# Altium schematic sheet A2D_ascii.SchDoc
size 513 x 386 mm
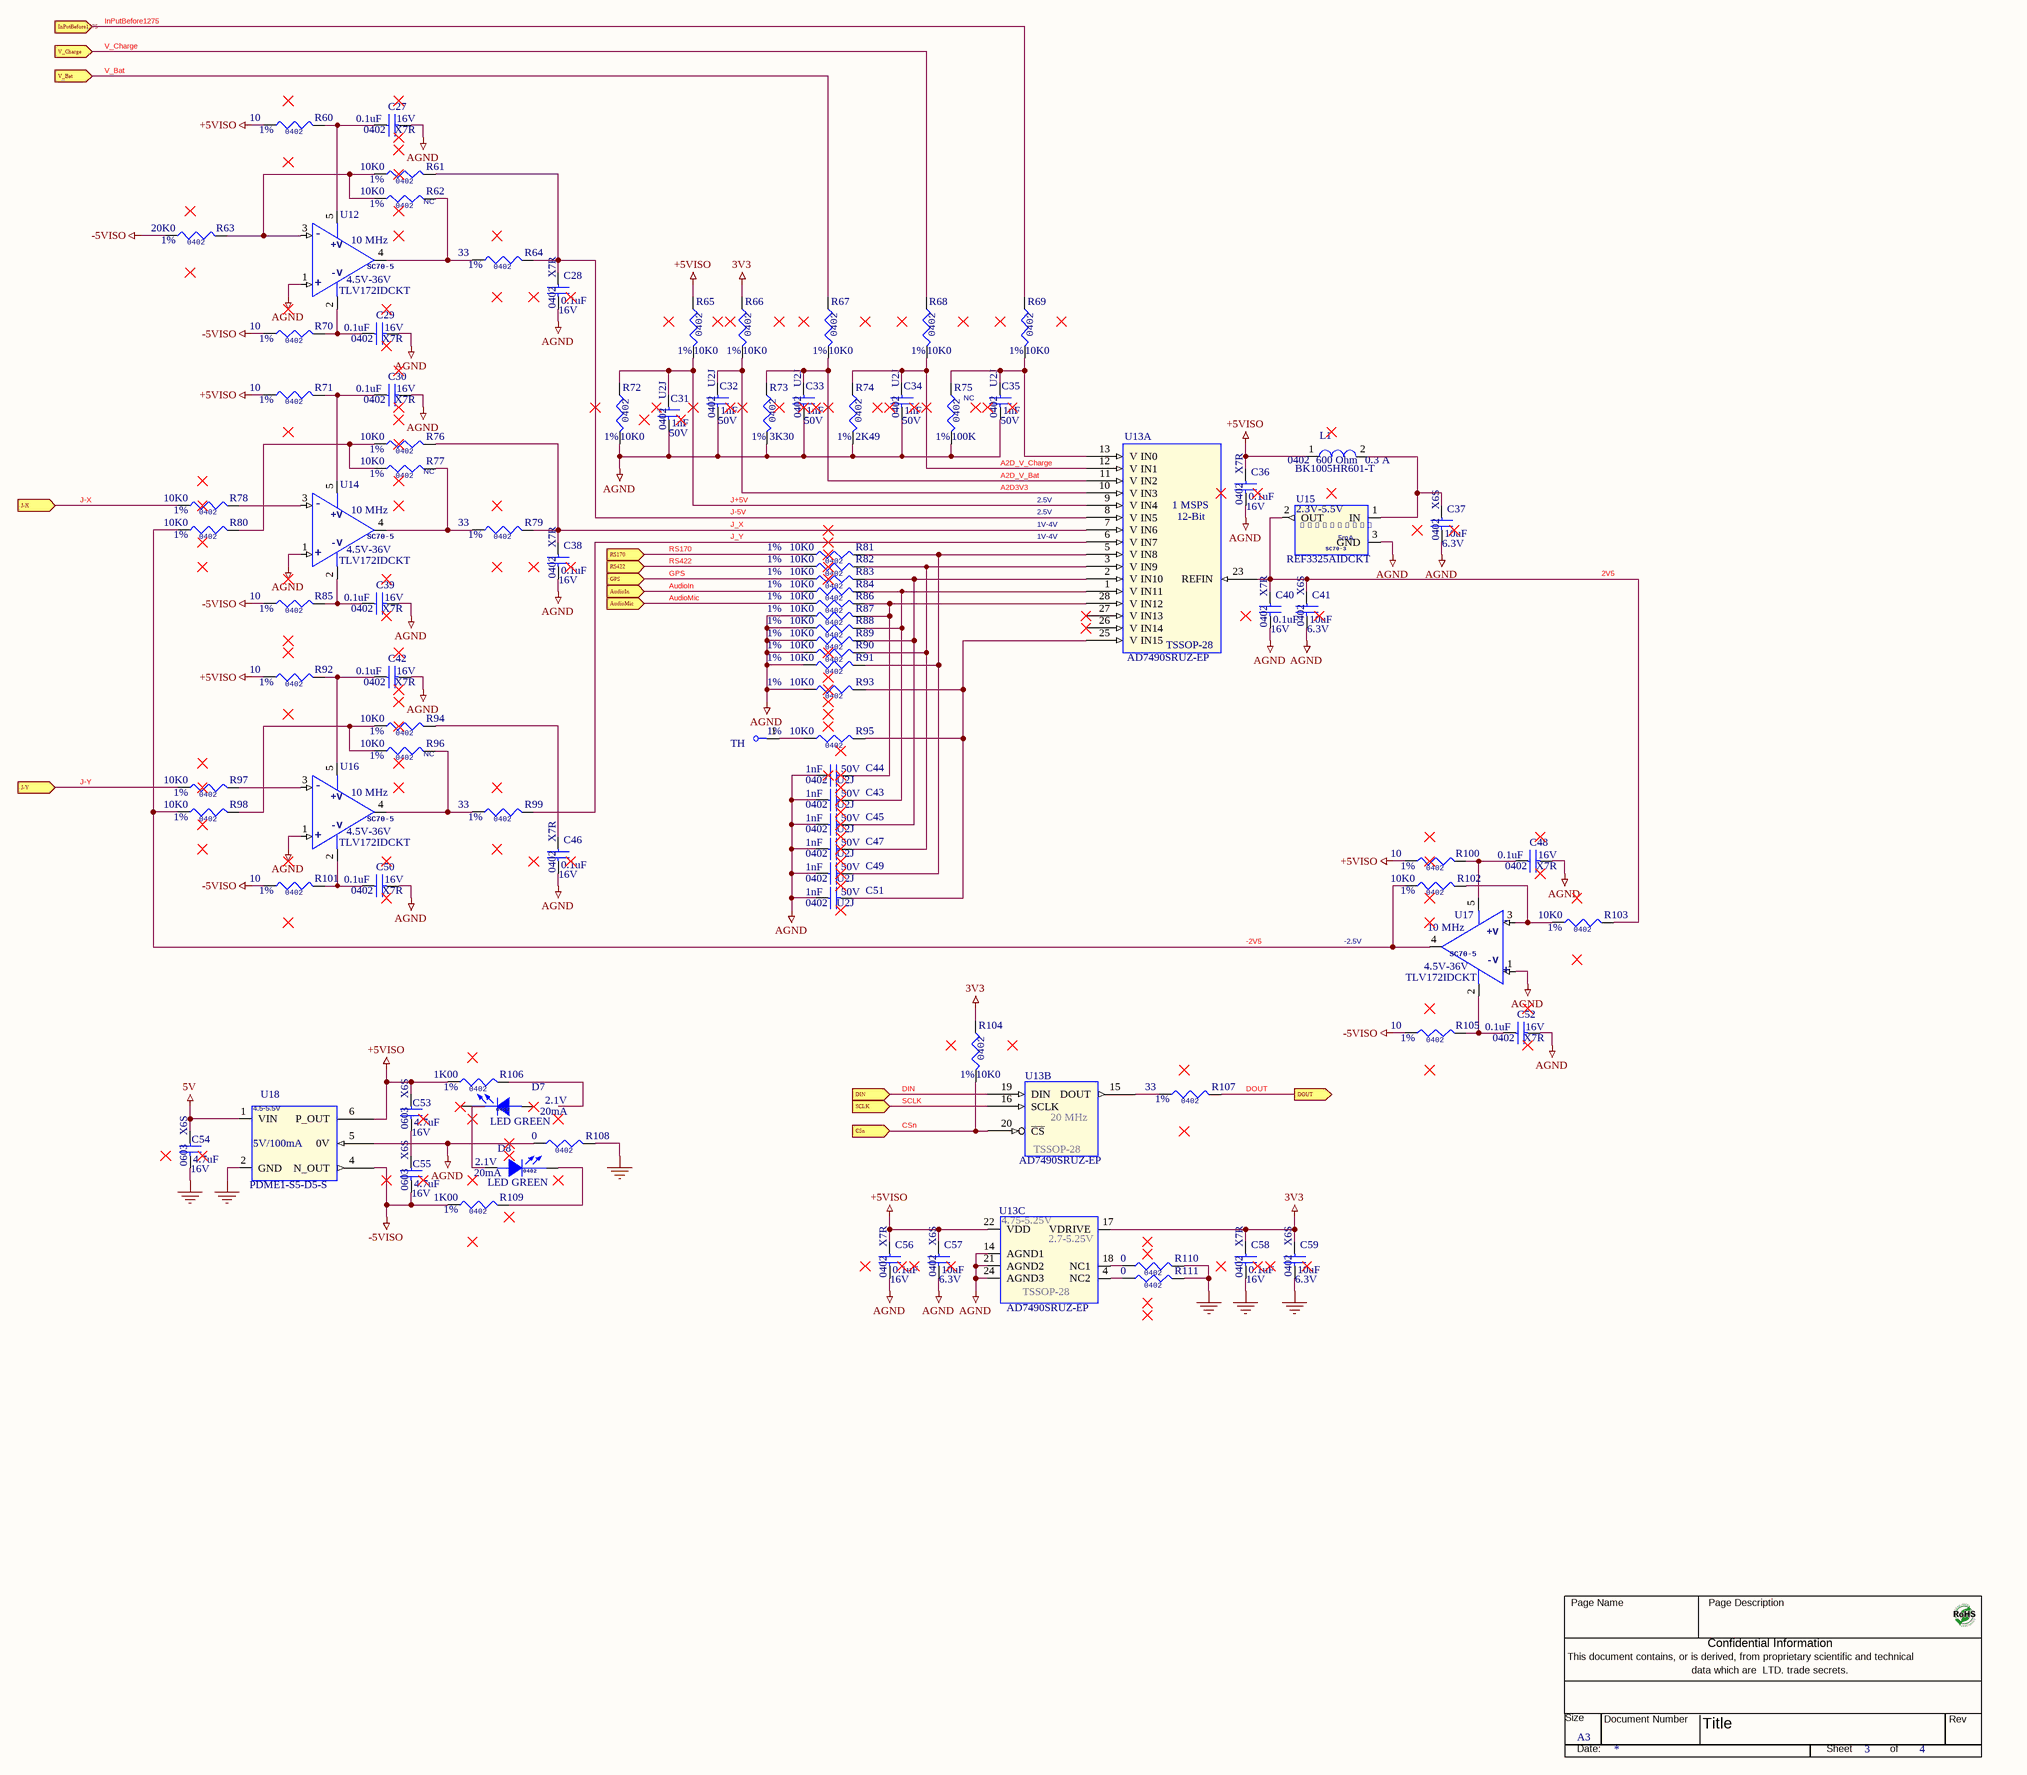
[diagram p0: A2D_ascii.SchDoc]

## Parts
*  Page Size: A3  Page Number: 3  Page Count: 4  (hidden comment: MobulusTitleBlockBlank)  (graphical)
C27  0.1uF  VOLTAGE: 16V  PCBFootPrint: 0402   X7R  [0402]
C28  0.1uF  VOLTAGE: 16V  PCBFootPrint: 0402   X7R  [0402]
C29  0.1uF  VOLTAGE: 16V  PCBFootPrint: 0402   X7R  [0402]
C30  0.1uF  VOLTAGE: 16V  PCBFootPrint: 0402   X7R  [0402]
C31  1nF  VOLTAGE: 50V  PCBFootPrint: 0402   U2J  [0402]
C32  1nF  VOLTAGE: 50V  PCBFootPrint: 0402   U2J  [0402]
C33  1nF  VOLTAGE: 50V  PCBFootPrint: 0402   U2J  [0402]
C34  1nF  VOLTAGE: 50V  PCBFootPrint: 0402   U2J  [0402]
C35  1nF  VOLTAGE: 50V  PCBFootPrint: 0402   U2J  [0402]
C36  0.1uF  VOLTAGE: 16V  PCBFootPrint: 0402   X7R  [0402]
C37  10uF  VOLTAGE: 6.3V  PCBFootPrint: 0402   X6S  [0402]
C38  0.1uF  VOLTAGE: 16V  PCBFootPrint: 0402   X7R  [0402]
C39  0.1uF  VOLTAGE: 16V  PCBFootPrint: 0402   X7R  [0402]
C40  0.1uF  VOLTAGE: 16V  PCBFootPrint: 0402   X7R  [0402]
C41  10uF  VOLTAGE: 6.3V  PCBFootPrint: 0402   X6S  [0402]
C42  0.1uF  VOLTAGE: 16V  PCBFootPrint: 0402   X7R  [0402]
C43  1nF  VOLTAGE: 50V  PCBFootPrint: 0402   U2J  [0402]
C44  1nF  VOLTAGE: 50V  PCBFootPrint: 0402   U2J  [0402]
C45  1nF  VOLTAGE: 50V  PCBFootPrint: 0402   U2J  [0402]
C46  0.1uF  VOLTAGE: 16V  PCBFootPrint: 0402   X7R  [0402]
C47  1nF  VOLTAGE: 50V  PCBFootPrint: 0402   U2J  [0402]
C48  0.1uF  VOLTAGE: 16V  PCBFootPrint: 0402   X7R  [0402]
C49  1nF  VOLTAGE: 50V  PCBFootPrint: 0402   U2J  [0402]
C50  0.1uF  VOLTAGE: 16V  PCBFootPrint: 0402   X7R  [0402]
C51  1nF  VOLTAGE: 50V  PCBFootPrint: 0402   U2J  [0402]
C52  0.1uF  VOLTAGE: 16V  PCBFootPrint: 0402   X7R  [0402]
C53  4.7uF  VOLTAGE: 16V  PCBFootPrint: 0603   X6S  [0603]
C54  4.7uF  VOLTAGE: 16V  PCBFootPrint: 0603   X6S  [0603]
C55  4.7uF  VOLTAGE: 16V  PCBFootPrint: 0603   X6S  [0603]
C56  0.1uF  VOLTAGE: 16V  PCBFootPrint: 0402   X7R  [0402]
C57  10uF  VOLTAGE: 6.3V  PCBFootPrint: 0402   X6S  [0402]
C58  0.1uF  VOLTAGE: 16V  PCBFootPrint: 0402   X7R  [0402]
C59  10uF  VOLTAGE: 6.3V  PCBFootPrint: 0402   X6S  [0402]
D7  LED GREEN  VOLTAGE: 2.1V  Current: 20mA  [LED_0402]
D8  LED GREEN  VOLTAGE: 2.1V  Current: 20mA  [LED_0402]
ICT1  TH  [ICT]
L1  BK1005HR601-T  Impedance: 600 Ohm  PcbFootPrint: 0402  Current: 0.3 A  [L0402]
R60  10  Tolerance: 1%  [0402]
R61  10K0  Tolerance: 1%  [0402]
R62  10K0  Tolerance: 1%  ASSY: NC  [0402]
R63  20K0  Tolerance: 1%  [0402]
R64  33  Tolerance: 1%  [0402]
R65  10K0  Tolerance: 1%  [0402]
R66  10K0  Tolerance: 1%  [0402]
R67  10K0  Tolerance: 1%  [0402]
R68  10K0  Tolerance: 1%  [0402]
R69  10K0  Tolerance: 1%  [0402]
R70  10  Tolerance: 1%  [0402]
R71  10  Tolerance: 1%  [0402]
R72  10K0  Tolerance: 1%  [0402]
R73  3K30  Tolerance: 1%  [0402]
R74  2K49  Tolerance: 1%  [0402]
R75  100K  Tolerance: 1%  ASSY: NC  [0402]
R76  10K0  Tolerance: 1%  [0402]
R77  10K0  Tolerance: 1%  ASSY: NC  [0402]
R78  10K0  Tolerance: 1%  [0402]
R79  33  Tolerance: 1%  [0402]
R80  10K0  Tolerance: 1%  [0402]
R81  10K0  Tolerance: 1%  [0402]
R82  10K0  Tolerance: 1%  [0402]
R83  10K0  Tolerance: 1%  [0402]
R84  10K0  Tolerance: 1%  [0402]
R85  10  Tolerance: 1%  [0402]
R86  10K0  Tolerance: 1%  [0402]
R87  10K0  Tolerance: 1%  [0402]
R88  10K0  Tolerance: 1%  [0402]
R89  10K0  Tolerance: 1%  [0402]
R90  10K0  Tolerance: 1%  [0402]
R91  10K0  Tolerance: 1%  [0402]
R92  10  Tolerance: 1%  [0402]
R93  10K0  Tolerance: 1%  [0402]
R94  10K0  Tolerance: 1%  [0402]
R95  10K0  Tolerance: 1%  [0402]
R96  10K0  Tolerance: 1%  ASSY: NC  [0402]
R97  10K0  Tolerance: 1%  [0402]
R98  10K0  Tolerance: 1%  [0402]
R99  33  Tolerance: 1%  [0402]
R100  10  Tolerance: 1%  [0402]
R101  10  Tolerance: 1%  [0402]
R102  10K0  Tolerance: 1%  [0402]
R103  10K0  Tolerance: 1%  [0402]
R104  10K0  Tolerance: 1%  [0402]
R105  10  Tolerance: 1%  [0402]
R106  1K00  Tolerance: 1%  [0402]
R107  33  Tolerance: 1%  [0402]
R108  0  [0402]
R109  1K00  Tolerance: 1%  [0402]
R110  0  [0402]
R111  0  [0402]
U12  TLV172IDCKT  Bandwidth: 10 MHz  VOLTAGE: 4.5V-36V  [SC70-5_TLV172IDCKT]
U13  AD7490SRUZ-EP  Throughput rates: 1 MSPS  Resolution: 12-Bit  PcbFootprint: TSSOP-28  [TSSOP-28_AD7490SRUZ]  (parts A,B,C of 3)
U14  TLV172IDCKT  Bandwidth: 10 MHz  VOLTAGE: 4.5V-36V  [SC70-5_TLV172IDCKT]
U15  REF3325AIDCKT  Current: 5mA  Definition: 2.5V�0.15%  Voltage: 2.3V-5.5V  [SC70-3_REF3320AIDCKR]
U16  TLV172IDCKT  Bandwidth: 10 MHz  VOLTAGE: 4.5V-36V  [SC70-5_TLV172IDCKT]
U17  TLV172IDCKT  Bandwidth: 10 MHz  VOLTAGE: 4.5V-36V  [SC70-5_TLV172IDCKT]
U18  PDME1-S5-D5-S  Power: 4.5-5.5V  Voltage: 5V/100mA  [PDME1-S5-D5-S]

## Ports
AudioIn (in), AudioMic (in), CSn (in), DIN (in), DOUT (out), GPS (in), InPutBefore1275 (in), J-X (in), J-Y (in), RS170 (in), RS422 (in), SCLK (in), V_Bat (in), V_Charge (in)

## Nets
3V3: C58.1 C59.1 R66.1 R104.1 U13.17(VDRIVE)
5V: C54.1 U18.1(VIN)
+5VISO: C36.1 C53.1 C56.1 C57.1 L1.1 R60.1 R65.1 R71.1 R92.1 R100.1 R106.1 U13.22(VDD) U18.6(P_OUT)
-5VISO: C55.2 R63.1 R70.1 R85.1 R101.1 R105.1 R109.1 U18.4(N_OUT)
AGND: C27.2 C28.2 C29.2 C30.2 C31.2 C32.2 C33.2 C34.2 C35.2 C36.2 C37.2 C38.2 C39.2 C40.2 C41.2 C42.2 C43.1 C44.1 C45.1 C46.2 C47.1 C48.2 C49.1 C50.2 C51.1 C52.2 C56.2 C57.2 R72.2 R73.2 R74.2 R75.2 R87.1 R88.1 R89.1 R90.1 R91.1 R93.1 R108.1 U12.1(+In) U13.14(AGND1) U13.21(AGND2) U13.24(AGND3) U14.1(+In) U15.3(GND) U16.1(+In) U17.1(+In) U18.5(0V)
GND: C54.2 C58.2 C59.2 R108.2 R110.2 R111.2 U18.2(GND)
2V5: C40.1 C41.1 R103.2 U13.23(REFIN) U15.2(OUT)
-2V5: R80.1 R98.1 R102.1 U17.4(OutPut)
A2D3V3: C32.1 R66.2 U13.10(V_IN3)
A2D_V_Bat: C33.1 R67.2 R73.1 U13.11(V_IN2)
A2D_V_Charge: C34.1 R68.2 R74.1 U13.12(V_IN1)
AudioIn: R84.1 ; port AudioIn
AudioMic: R86.1 ; port AudioMic
CSn: R104.2 U13.20(~{CS}) ; port CSn
DIN: U13.19(DIN) ; port DIN
DOUT: R107.2 ; port DOUT
GPS: R83.1 ; port GPS
InPutBefore1275: R69.1 ; port InPutBefore1275
J+5V: C31.1 R65.2 R72.1 U13.9(V_IN4)
J-5V: C28.1 R61.2 R64.2 U13.8(V_IN5)
J-X: R78.1 ; port J-X
J-Y: R97.1 ; port J-Y
J_X: C38.1 R76.2 R79.2 U13.7(V_IN6)
J_Y: R99.2 U13.6(V_IN7)
RS170: R81.1 ; port RS170
RS422: R82.1 ; port RS422
SCLK: U13.16(SCLK) ; port SCLK
V_Bat: R67.1 ; port V_Bat
V_Charge: R68.1 ; port V_Charge
NetC27_1: C27.1 R60.2 U12.5(+V)
NetC29_1: C29.1 R70.2 U12.2(-V)
NetC30_1: C30.1 R71.2 U14.5(+V)
NetC35_1: C35.1 R69.2 R75.1 U13.13(V_IN0)
NetC37_1: C37.1 L1.2 U15.1(IN)
NetC39_1: C39.1 R85.2 U14.2(-V)
NetC42_1: C42.1 R92.2 U16.5(+V)
NetC43_2: C43.2 R84.2 R88.2 U13.1(V_IN11)
NetC44_2: C44.2 R86.2 R87.2 U13.28(V_IN12)
NetC45_2: C45.2 R83.2 R89.2 U13.2(V_IN10)
NetC46_1: C46.1 R94.2
NetC47_2: C47.2 R82.2 R90.2 U13.3(V_IN9)
NetC48_1: C48.1 R100.2 U17.5(+V)
NetC49_2: C49.2 R81.2 R91.2 U13.5(V_IN8)
NetC50_1: C50.1 R101.2 U16.2(-V)
NetC51_2: C51.2 R93.2 R95.2 U13.25(V_IN15)
NetC52_1: C52.1 R105.2 U17.2(-V)
NetC53_2: C53.2 C55.1
NetD8_1: D8.1(C) R109.2
NetICT1_1: ICT1.1 R95.1
NetR61_1: R61.1 R62.1 R63.2 U12.3(-In)
NetR62_2: R62.2 R64.1 U12.4(OutPut)
NetR76_1: R76.1 R77.1 R80.2
NetR77_2: R77.2 R79.1 U14.4(OutPut)
NetR78_2: R78.2 U14.3(-In)
NetR94_1: R94.1 R96.1 R98.2
NetR96_2: R96.2 R99.1 U16.4(OutPut)
NetR97_2: R97.2 U16.3(-In)
NetR102_2: R102.2 R103.1 U17.3(-In)
NetR107_1: R107.1 U13.15(DOUT)
NetR110_1: R110.1 U13.18(NC1)
NetR111_1: R111.1 U13.4(NC2)

Not connected (* = marked no-connect by the designer): D7 1(C)* 2(A)*; D8 2(A)*; R106 2; U13 26(V_IN14)* 27(V_IN13)*

## Notes on the sheet
- 2.5V
- 1V-4V
- -2.5V
- (in symbol LED_0402_GREEN) 0402
- (in symbol MobulusTitleBlockBlank) Page Name; Page Description; Confidential Information; This document contains, or is derived, from proprietary scientific and technical; data which are  LTD. trade secrets.; Size; Document Number; Rev; Title; Date:; Sheet; of
- (in symbol R0402_0R_5%) 0402
- (in symbol R0402_1K00_1%) 0402
- (in symbol R0402_2K49_1%) 0402
- (in symbol R0402_3K30_1%) 0402
- (in symbol R0402_10K0_1%) 0402
- (in symbol R0402_10R_1%) 0402
- (in symbol R0402_20K0_1%) 0402
- (in symbol R0402_33R_1%) 0402
- (in symbol R0402_100K_1%) 0402
- (in symbol REF3325AIDCKT) SC70-3
- (in symbol TLV172IDCKT) -; SC70-5; +

## Library data of the parts
* = MobulusTitleBlockBlank: Schematic Page Count: 1; Page Create Date: March  8, 1995; Page Modify Date: *; Schematic Page Number: 1
C27-C30 C36 C38-C40 C42 C46 C48 C50 C52 C56 C58 = CAP0402_0.1uF 16V: CAP_CER_0.1uF_16V_X7R_0402; Part Number: CC0402KRX7R7BB104; NO_XNET_CONNECTION: True; TYPE: X7R; OVPN: OVCC00002; MFG: Yageo; ALT_SYMBOLS_HARD: 0402_RND; ALT_SYMBOLS: 0402_RND; PCB Footprint: 0402
C31-C35 C43-C45 C47 C49 C51 = CAP0402_1nF 50V: CAP_CER_1nF_50V_0402_U2J; Part Number: C0402C102J5JAC7867; TYPE: U2J; OVPN: OVCC00016; NO_XNET_CONNECTION: True; MFG: KEMET; ALT_SYMBOLS: 0402_RND; PCB Footprint: 0402
C37 C41 C57 C59 = CAP0402_10uF 6.3V: CAP CER 10UF 6.3V X6S 0402; Part Number: GRM155C80J106ME11J; OVPN: OVCC00087; NO_XNET_CONNECTION: True; MFG: Murata Electronics; TYPE: X6S; PCB Footprint: 0402
C53-C55 = CAP0603_4.7uF 16V: CAP_CER_4.7UF_16V_X6S_0603; Part Number: C1608X6S1C475M080AC; OVPN: OVCC00034; NO_XNET_CONNECTION: True; MFG: TDK Corporation; PCB Footprint: 0603
D7 D8 = LED_0402_GREEN: LED GREEN CLEAR CHIP SMD; PART Number: XZVG68W-2; OVPN: OVLS00001; MFG: SunLED; PCB Footprint: LED_0402
ICT1 = ICT: ASSY: N/A; PCB Footprint: ICT
L1 = BK1005HR601-T 600 0.3A: FERRITE BEAD 600 OHM 0402 1LN; OVPN: OVLF00014; NO_XNET_CONNECTION: True; MFG: Taiyo Yuden; Part Number: BK1005HR601-T; PCB Footprint: L0402
R60 R70 R71 R85 R92 R100 R101 R105 = R0402_10R_1%: RES SMD 10 OHM 1% 1/16W 0402; Part Number: RC0402FR-0710RL; NO_XNET_CONNECTION: True; OVPN: OVRS00036; MFG: Yageo; Power: 1/16W; MOUNTING: SMT
R61 R62 R65-R69 R72 R76-R78 R80-R84 R86-R91 R93-R98 R102-R104 = R0402_10K0_1%: RES SMD 10K OHM 1% 1/16W 0402; Part Number: RC0402FR-0710KL; NO_XNET_CONNECTION: True; OVPN: OVRS00009; MFG: Yageo; Power: 1/16W; MOUNTING: SMT
R63 = R0402_20K0_1%: RES SMD 20K OHM 1% 1/16W 0402; Part Number: RC0402FR-0720KL; OVPN: OVRS00142; NO_XNET_CONNECTION: True; MFG: Yageo; Power: 1/16W; MOUNTING: SMT
R64 R79 R99 R107 = R0402_33R_1%: RES 33R 1% 1/5W 0402; Part Number: RCS040233R0FKED; NO_XNET_CONNECTION: True; Power: 1/16W; OVPN: OVRS00013; MFG: Vishay Dale; MOUNTING: SMT
R73 = R0402_3K30_1%: RES 3K3 1% 1/16W 0402; Part Number: RT0402FRE073K3L; OVPN: OVRS00028; NO_XNET_CONNECTION: True; MFG: Yageo; Power: 1/16W; MOUNTING: SMT
R74 = R0402_2K49_1%: RES 2K49 1% 1/16W 0402; Part Number: RC0402FR-072K49L; NO_XNET_CONNECTION: True; OVPN: OVRS00004; MFG: Yageo; Power: 1/16W; MOUNTING: SMT
R75 = R0402_100K_1%: RES SMD 100K OHM 1% 1/16W 0402; Part Number: RC0402FR-07100KL; NO_XNET_CONNECTION: True; OVPN: OVRS00003; MFG: Yageo; Power: 1/16W; MOUNTING: SMT
R106 R109 = R0402_1K00_1%: RES SMD 1K OHM 1% 1/16W 0402; Part Number: RC0402FR-071KL; NO_XNET_CONNECTION: True; OVPN: OVRS00022; MFG: Yageo; Power: 1/16W; MOUNTING: SMT
R108 R110 R111 = R0402_0R_5%: RES SMD 0 OHM JUMPER 1/16W 0402; Part Number: RC0402JR-070RL; NO_XNET_CONNECTION: True; OVPN: OVRS00001; MFG: Yageo; Current: 1A; Power: 1/16W; MOUNTING: SMT
U12 U14 U16 U17 = TLV172IDCKT: IC OPAMP GP 1 CIRCUIT SC70-5; MFG: Texas Instruments; OVPN: OVIC00220; PART NUMBER: TLV172IDCKT; PCB Footprint: SC70-5_TLV172IDCKT
U13 = AD7490SRUZ-EP: IC ADC 12BIT 1MSPS 16CH 28TSSOP; PART NUMBER: AD7490SRUZ-EP-RL7; fSCLK: 20 MHz; Voltage: 2.7-5.25V; VDD: 4.75-5.25V; OVPN: OVIC00219; MFG: Analog Devices Inc.; PCB Footprint: TSSOP-28_AD7490SRUZ
U15 = REF3325AIDCKT: IC VREF SERIES 0.15% SC70-3; MFG: Texas Instruments; OVPN: OVIC00251; PART NUMBER: REF3325AIDCKT; PCB Footprint: SC70-3_REF3320AIDCKR
U18 = PDME1-S5-D5-S: DC DC CONVERTER +/-5V 1W; MFG: CUI Inc.; OVPN: OVIC00225; PART NUMBER: PDME1-S5-D5-S; PCB Footprint: PDME1-S5-D5-S